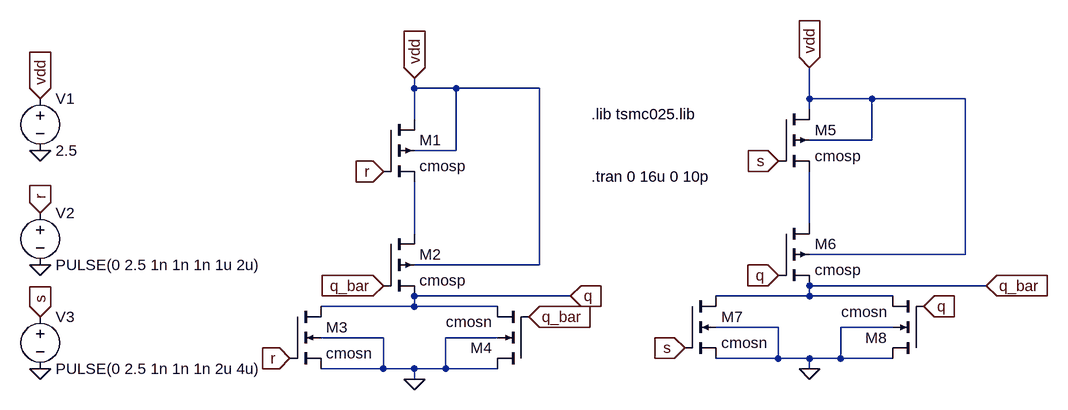
[diagram p0: schematic mar-12-nor_based_latch.asc]
mar-12-nor_based_latch.asc, the LTspice schematic file:
Version 4
SHEET 1 1248 680
WIRE 240 0 240 -16
WIRE 304 0 240 0
WIRE 432 0 304 0
WIRE 848 16 848 -32
WIRE 944 16 848 16
WIRE 1088 16 944 16
WIRE 848 32 848 16
WIRE 240 48 240 0
WIRE 944 80 944 16
WIRE 944 80 848 80
WIRE 304 96 304 0
WIRE 304 96 240 96
WIRE 848 208 848 128
WIRE 240 224 240 144
WIRE 1088 256 1088 16
WIRE 1088 256 848 256
WIRE 432 272 432 0
WIRE 432 272 240 272
WIRE 1120 304 848 304
WIRE 480 320 240 320
WIRE 848 320 848 304
WIRE 848 320 704 320
WIRE 976 320 848 320
WIRE 240 336 240 320
WIRE 240 336 96 336
WIRE 368 336 240 336
WIRE 800 368 704 368
WIRE 976 368 896 368
WIRE 192 384 96 384
WIRE 368 384 288 384
WIRE 800 416 800 368
WIRE 800 416 704 416
WIRE 848 416 800 416
WIRE 896 416 896 368
WIRE 896 416 848 416
WIRE 976 416 896 416
WIRE 192 432 192 384
WIRE 192 432 96 432
WIRE 240 432 192 432
WIRE 288 432 288 384
WIRE 288 432 240 432
WIRE 368 432 288 432
WIRE 848 432 848 416
WIRE 240 448 240 432
FLAG 240 448 0
FLAG 240 -16 vdd
IOPIN 240 -16 In
FLAG 192 128 r
IOPIN 192 128 In
FLAG 192 304 q_bar
IOPIN 192 304 In
FLAG 48 416 r
IOPIN 48 416 In
FLAG 416 352 q_bar
IOPIN 416 352 In
FLAG -336 16 vdd
IOPIN -336 16 In
FLAG -336 96 0
FLAG 848 432 0
FLAG 848 -32 vdd
IOPIN 848 -32 In
FLAG 800 112 s
IOPIN 800 112 In
FLAG 800 288 q
IOPIN 800 288 In
FLAG 656 400 s
IOPIN 656 400 In
FLAG 1024 336 q
IOPIN 1024 336 In
FLAG -336 192 r
IOPIN -336 192 In
FLAG -336 352 s
IOPIN -336 352 In
FLAG -336 272 0
FLAG -336 432 0
FLAG 480 320 q
IOPIN 480 320 In
FLAG 1120 304 q_bar
IOPIN 1120 304 In
SYMBOL voltage -336 0 R0
WINDOW 123 0 0 Left 0
WINDOW 39 0 0 Left 0
SYMATTR InstName V1
SYMATTR Value 2.5
SYMBOL pmos4 192 48 R0
SYMATTR InstName M1
SYMATTR Value cmosp
SYMATTR Value2 l=240n w=360n
SYMBOL pmos4 192 224 R0
SYMATTR InstName M2
SYMATTR Value cmosp
SYMATTR Value2 l=240n w=360n
SYMBOL nmos4 48 336 R0
SYMATTR InstName M3
SYMATTR Value cmosn
SYMATTR Value2 l=240n w=360n
SYMBOL nmos4 416 432 R180
SYMATTR InstName M4
SYMATTR Value cmosn
SYMATTR Value2 l=240n w=360n
SYMBOL pmos4 800 32 R0
SYMATTR InstName M5
SYMATTR Value cmosp
SYMATTR Value2 l=240n w=360n
SYMBOL pmos4 800 208 R0
SYMATTR InstName M6
SYMATTR Value cmosp
SYMATTR Value2 l=240n w=360n
SYMBOL nmos4 656 320 R0
SYMATTR InstName M7
SYMATTR Value cmosn
SYMATTR Value2 l=240n w=360n
SYMBOL nmos4 1024 416 R180
SYMATTR InstName M8
SYMATTR Value cmosn
SYMATTR Value2 l=240n w=360n
SYMBOL voltage -336 176 R0
WINDOW 123 0 0 Left 0
WINDOW 39 0 0 Left 0
SYMATTR InstName V2
SYMATTR Value PULSE(0 2.5 1n 1n 1n 1u 2u)
SYMBOL voltage -336 336 R0
WINDOW 123 0 0 Left 0
WINDOW 39 0 0 Left 0
SYMATTR InstName V3
SYMATTR Value PULSE(0 2.5 1n 1n 1n 2u 4u)
TEXT 512 40 Left 2 !.lib tsmc025.lib
TEXT 512 136 Left 2 !.tran 0 16u 0 10p

The netlist it stands for:
* mar-12-nor_based_latch.asc
V1 vdd 0 2.5
M1 vdd r N002 vdd cmosp l=240n w=360n
M2 N002 q_bar q vdd cmosp l=240n w=360n
M3 q r 0 0 cmosn l=240n w=360n
M4 0 q_bar q 0 cmosn l=240n w=360n
M5 vdd s N001 vdd cmosp l=240n w=360n
M6 N001 q q_bar vdd cmosp l=240n w=360n
M7 q_bar s 0 0 cmosn l=240n w=360n
M8 0 q q_bar 0 cmosn l=240n w=360n
V2 r 0 PULSE(0 2.5 1n 1n 1n 1u 2u)
V3 s 0 PULSE(0 2.5 1n 1n 1n 2u 4u)
.model NMOS NMOS
.model PMOS PMOS
.lib standard.mos
.lib tsmc025.lib
.tran 0 16u 0 10p
.backanno
.end